# Altium schematic sheet Input.SchDoc
size A; SheetNumber: 4; SheetTotal: 8
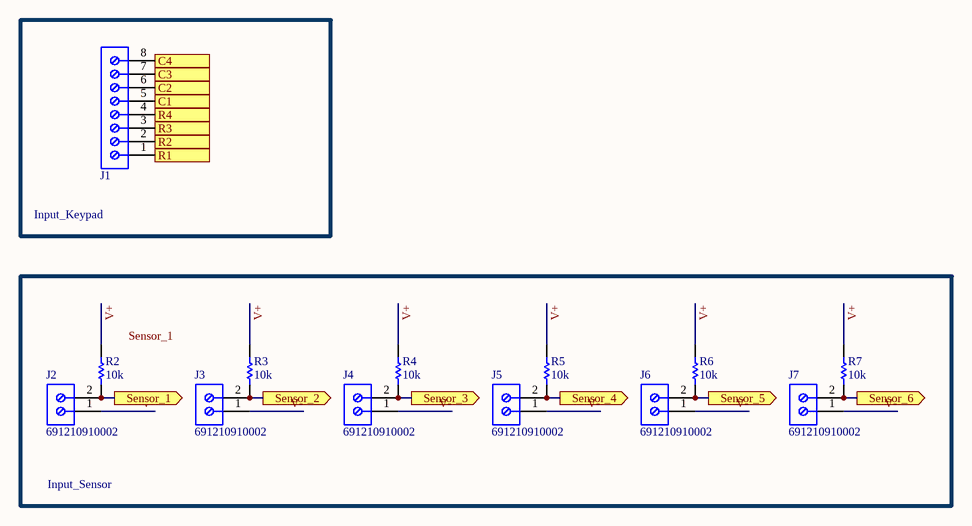
[diagram p0: Input.SchDoc]

## Parts
J1  691210910008  [691210910008]  (value not drawn)
J2  691210910002  [691210910002]
J3  691210910002  [691210910002]
J4  691210910002  [691210910002]
J5  691210910002  [691210910002]
J6  691210910002  [691210910002]
J7  691210910002  [691210910002]
R2  value 10k  [RES-SM-0603]  (hidden comment: ESR03EZPF1002)
R3  value 10k  [RES-SM-0603]  (hidden comment: ESR03EZPF1002)
R4  value 10k  [RES-SM-0603]  (hidden comment: ESR03EZPF1002)
R5  value 10k  [RES-SM-0603]  (hidden comment: ESR03EZPF1002)
R6  value 10k  [RES-SM-0603]  (hidden comment: ESR03EZPF1002)
R7  value 10k  [RES-SM-0603]  (hidden comment: ESR03EZPF1002)

## Blocks framed on the sheet
Input_Keypad: J1
Input_Sensor: J2-J7 R2-R7

## Ports
C1 (out), C2 (out), C3 (out), C4 (out), R1 (out), R2 (out), R3 (out), R4 (out), Sensor_1 (out), Sensor_2 (out), Sensor_3 (out), Sensor_4 (out), Sensor_5 (out), Sensor_6 (out)

## Nets
C1: J1.5 ; port C1
C2: J1.6 ; port C2
C3: J1.7 ; port C3
C4: J1.8 ; port C4
R1: J1.1 ; port R1
R2: J1.2 ; port R2
R3: J1.3 ; port R3
R4: J1.4 ; port R4
Sensor_1: J2.2 R2.1 ; port Sensor_1
Sensor_2: J3.2 R3.1 ; port Sensor_2
Sensor_3: J4.2 R4.1 ; port Sensor_3
Sensor_4: J5.2 R5.1 ; port Sensor_4
Sensor_5: J6.2 R6.1 ; port Sensor_5
Sensor_6: J7.2 R7.1 ; port Sensor_6
V+: R2.2 R3.2 R4.2 R5.2 R6.2 R7.2
V-: J2.1 J3.1 J4.1 J5.1 J6.1 J7.1

## Notes on the sheet
- Labels drawn without touching a wire or pin: Sensor_1

## Library data of the parts
J1 = 691210910008: WR-TBL Series 2109 Horizontal Entry, Through Hole, pitch 2.54mm, 8p; Manufacturer: Wurth Elektronik; Pin Number: 8; Rated Current: 6A; Working Voltage: 150V; PCB/Cable/Panel: PCB; Modularity: No; No. Pad (SMD): 0; ComponentLink1Description: Manufacturer Link; ComponentLink1URL: https://www.we-online.com/redexpert/article/691210910008?ad; ComponentLink2Description: Datasheet; ComponentLink2URL: https://www.we-online.com/redexpert/spec/691210910008?ad; Category: Terminal Blocks; Match Code: WR-TBL; Manufacturer Part Number: 691210910008; Mount: Through Hole; Operating Temperature Max: 105°C; Operating Temperature Min: -40°C; Packaging: Box; Pitch: 2.54mm; Orientation: Horizontal; Application: Rising Cage Clamp; No. Pad (THT): 8; Unit Price (Digikey): 3.93
J2-J7 = 691210910002: WR-TBL Serie 2109 Horizontal Entry, Rising Cage Clamp, pitch 2.54mm, 2p; Compliance: Lead free / RoHS; Modularity: No; PCB/Cable/Panel: PCB; Pin Number: 2; Rated Current [UL]: 6A; Working Voltage [UL]: 150VAC; No. Pad (SMD): 0; ComponentLink1Description: Manufacturer; ComponentLink1URL: http://www.we-online.de; ComponentLink2URL: https://katalog.we-online.de/em/datasheet/691210910002.pdf; ComponentLink2Description: Datasheet; Mounting Technology: THT; Part Number: 691210910002; Packaging: Box; Operating Temperature: -40 to +105degC; Pitch: 2.54mm; Published Date: October 2019; Type: Horizontal; Publisher: Wurth Elektronik; Application: Rising Cage Clamp; No. Pad (THT): 2; Unit Price (Digikey): 1.14
R2-R7 = RESISTOR SMD: RES SMD 10K OHM 1% 1/4W 0603; Mfr: Rohm Semiconductor; Resistance: 10 kOhms; Power (Watts): 0.25W, 1/4W; Temperature Coefficient: ±100ppm/°C; No. Pad (SMD): 2; No. Pad (THT): 0; Series: ESR; Tolerance: ±1%; Composition: Thick Film; Features: Automotive AEC-Q200, Pulse Withstanding; Operating Temperature: -55°C ~ 155°C; Package / Case: 0603 (1608 Metric); Supplier Device Package: 0603; Ratings: AEC-Q200; Size / Dimension: 0.063" L x 0.031" W (1.60mm x 0.80mm); Height - Seated (Max): 0.022" (0.55mm); Number of Terminations: 2; Unit Price (Digikey): 0.15
  R2: ComponentLink1Description: Digikey; ComponentLink1URL: https://www.digikey.com/en/products/detail/rohm-semiconductor/ESR03EZPF1002/1983429?s=N4IgTCBcDaIKIGUBKAGAzHAWgBQGIEYUUIBdAXyA